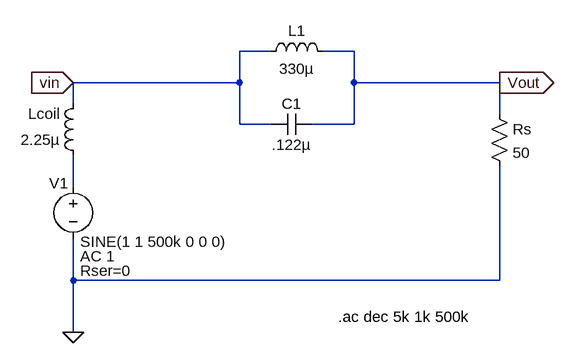
[diagram p0: schematic Bandstop receiving .asc]
Bandstop receiving .asc, the LTspice schematic file:
Version 4
SHEET 1 880 680
WIRE 160 112 112 112
WIRE 288 112 240 112
WIRE 112 160 112 112
WIRE 112 160 -144 160
WIRE 288 160 288 112
WIRE 512 160 288 160
WIRE -144 192 -144 160
WIRE 512 208 512 160
WIRE 112 224 112 160
WIRE 160 224 112 224
WIRE 288 224 288 160
WIRE 288 224 224 224
WIRE -144 320 -144 272
WIRE -144 464 -144 400
WIRE 512 464 512 288
WIRE 512 464 -144 464
WIRE -144 544 -144 464
FLAG -144 544 0
FLAG 512 160 Vout
IOPIN 512 160 Out
FLAG -144 160 vin
IOPIN -144 160 In
SYMBOL voltage -144 304 R0
WINDOW 0 -37 11 Left 2
WINDOW 3 11 101 Left 2
WINDOW 123 11 123 Left 2
WINDOW 39 11 145 Left 2
SYMATTR InstName V1
SYMATTR Value SINE(1 1 500k 0 0 0)
SYMATTR Value2 AC 1
SYMATTR SpiceLine Rser=0
SYMBOL res 496 192 R0
SYMATTR InstName Rs
SYMATTR Value 50
SYMBOL cap 224 208 R90
WINDOW 0 0 32 VBottom 2
WINDOW 3 32 32 VTop 2
SYMATTR InstName C1
SYMATTR Value .122µ
SYMBOL ind 144 128 R270
WINDOW 0 32 56 VTop 2
WINDOW 3 5 56 VBottom 2
SYMATTR InstName L1
SYMATTR Value 330µ
SYMBOL ind -128 288 R180
WINDOW 0 36 80 Left 2
WINDOW 3 36 40 Left 2
SYMATTR InstName Lcoil
SYMATTR Value 2.25µ
TEXT 264 520 Left 2 !.ac dec 5k 1k 500k

The netlist it stands for:
* Bandstop receiving .asc
V1 N001 0 SINE(1 1 500k 0 0 0) AC 1 Rser=0
Rs Vout 0 50
C1 Vout vin .122µ
L1 vin Vout 330µ
Lcoil N001 vin 2.25µ
.ac dec 5k 1k 500k
.backanno
.end